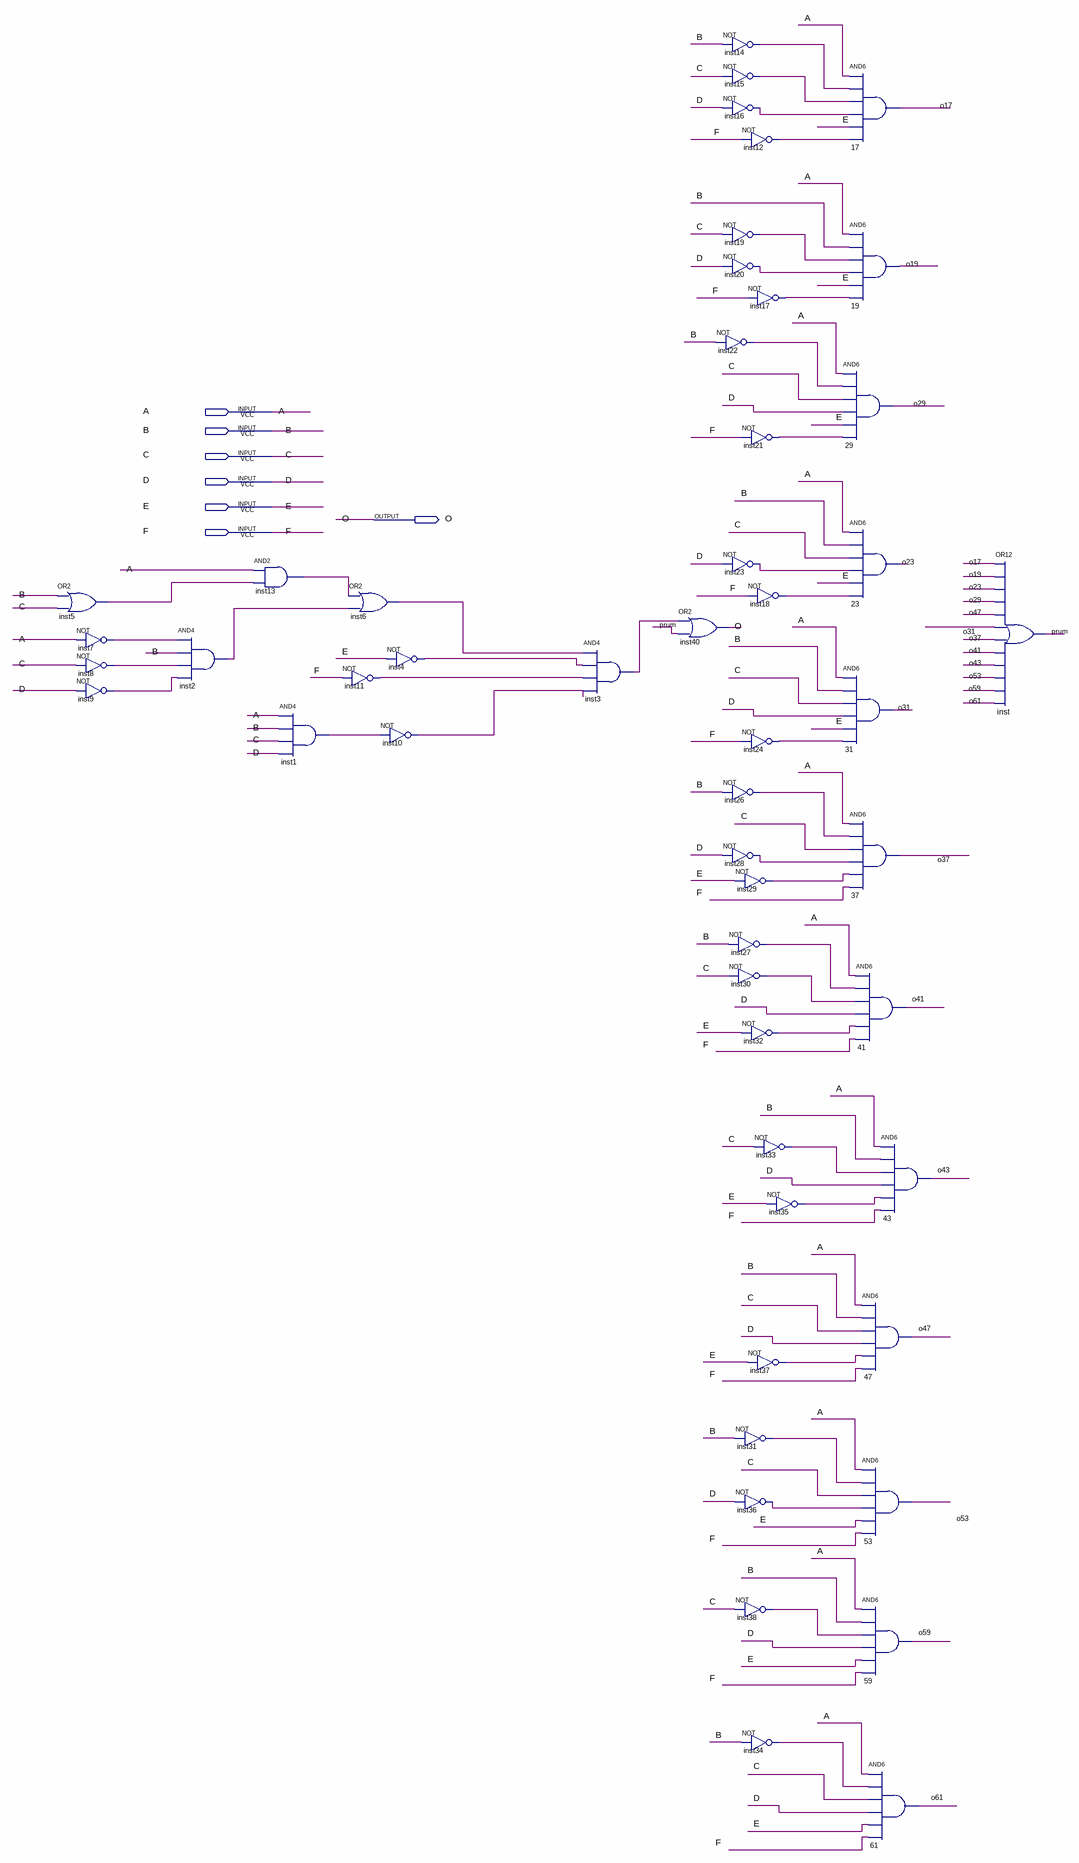
[diagram p0: schematic sheet]
// Quartus schematic prime2.bdf as structural Verilog: 51 symbols, 7 pins
module prime2 (
  input  A,
  input  B,
  input  C,
  input  D,
  input  E,
  input  F,
  output O
);

  wire inst1_out, inst2_out, inst3_out, inst4_out, inst5_out, inst6_out, inst7_out, inst8_out, inst9_out,
       inst10_out, inst11_out, inst12_out, inst13_out, inst14_out, inst15_out, inst16_out, inst17_out,
       inst18_out, inst19_out, inst20_out, inst21_out, inst22_out, inst23_out, inst24_out, inst26_out,
       inst27_out, inst28_out, inst29_out, inst30_out, inst31_out, inst32_out, inst33_out, inst34_out,
       inst35_out, inst36_out, inst37_out, inst38_out, o17, o19, o23, o29, o31, o37, o41, o43, o47, o53, o59,
       o61, prum;

  or inst5 (inst5_out, B, C);
  not inst7 (inst7_out, A);
  not inst8 (inst8_out, C);
  not inst9 (inst9_out, D);
  and inst2 (inst2_out, inst7_out, B, inst8_out, inst9_out);
  and inst13 (inst13_out, A, inst5_out);
  and inst1 (inst1_out, A, B, C, D);
  or inst6 (inst6_out, inst13_out, inst2_out);
  not inst11 (inst11_out, F);
  not inst4 (inst4_out, E);
  not inst10 (inst10_out, inst1_out);
  and inst3 (inst3_out, inst6_out, inst4_out, inst11_out, inst10_out);
  or inst40 (O, inst3_out, prum);
  not inst14 (inst14_out, B);
  not inst15 (inst15_out, C);
  not inst16 (inst16_out, D);
  not inst19 (inst19_out, C);
  not inst20 (inst20_out, D);
  not inst22 (inst22_out, B);
  not inst23 (inst23_out, D);
  not inst26 (inst26_out, B);
  not inst28 (inst28_out, D);
  not inst27 (inst27_out, B);
  not inst30 (inst30_out, C);
  not inst12 (inst12_out, F);
  not inst17 (inst17_out, F);
  not inst21 (inst21_out, F);
  not inst18 (inst18_out, F);
  not inst24 (inst24_out, F);
  not inst29 (inst29_out, E);
  not inst32 (inst32_out, E);
  not inst33 (inst33_out, C);
  not inst35 (inst35_out, E);
  not inst37 (inst37_out, E);
  not inst31 (inst31_out, B);
  not inst36 (inst36_out, D);
  not inst38 (inst38_out, C);
  not inst34 (inst34_out, B);
  and u_17 (o17, A, inst14_out, inst15_out, inst16_out, E, inst12_out);
  and u_19 (o19, A, B, inst19_out, inst20_out, E, inst17_out);
  and u_29 (o29, A, inst22_out, C, D, E, inst21_out);
  and u_23 (o23, A, B, C, inst23_out, E, inst18_out);
  and u_31 (o31, A, B, C, D, E, inst24_out);
  and u_37 (o37, A, inst26_out, C, inst28_out, inst29_out, F);
  and u_41 (o41, A, inst27_out, inst30_out, D, inst32_out, F);
  and u_43 (o43, A, B, inst33_out, D, inst35_out, F);
  and u_47 (o47, A, B, C, D, inst37_out, F);
  and u_53 (o53, A, inst31_out, C, inst36_out, E, F);
  and u_59 (o59, A, B, inst38_out, D, E, F);
  and u_61 (o61, A, inst34_out, C, D, E, F);
  or inst (prum, o17, o19, o23, o29, o47, o31, o37, o41, o43, o53, o59, o61);
endmodule
